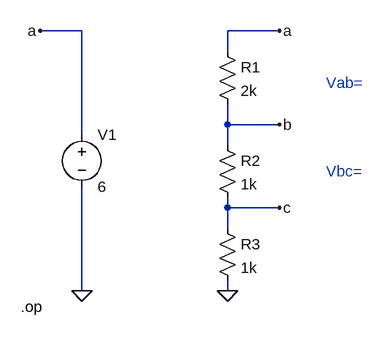
[diagram p0: schematic temp1.asc]
temp1.asc, the LTspice schematic file:
Version 4
SHEET 1 880 680
WIRE 80 0 16 0
WIRE 384 0 304 0
WIRE 304 32 304 0
WIRE 304 144 304 112
WIRE 384 144 304 144
WIRE 80 160 80 0
WIRE 304 176 304 144
WIRE 304 272 304 256
WIRE 384 272 304 272
WIRE 304 304 304 272
WIRE 80 400 80 240
WIRE 304 400 304 384
FLAG 80 400 0
FLAG 384 0 a
FLAG 384 144 b
FLAG 384 272 c
FLAG 304 400 0
FLAG 16 0 a
DATAFLAG 544 96 "V(a)-V(b)"
DATAFLAG 544 224 "V(b)-V(c)"
SYMBOL voltage 80 144 R0
WINDOW 123 0 0 Left 0
WINDOW 39 0 0 Left 0
SYMATTR InstName V1
SYMATTR Value 6
SYMBOL res 288 16 R0
SYMATTR InstName R1
SYMATTR Value 2k
SYMBOL res 288 160 R0
SYMATTR InstName R2
SYMATTR Value 1k
SYMBOL res 288 288 R0
SYMATTR InstName R3
SYMATTR Value 1k
TEXT 456 80 Left 2 ;Vab=
TEXT 456 216 Left 2 ;Vbc=
TEXT -14 424 Left 2 !.op

The netlist it stands for:
* temp1.asc
V1 a 0 6
R1 a b 2k
R2 b c 1k
R3 c 0 1k
* Vab=
* Vbc=
.op
.backanno
.end